# EAGLE design cooldrv (EAGLE 5.11)
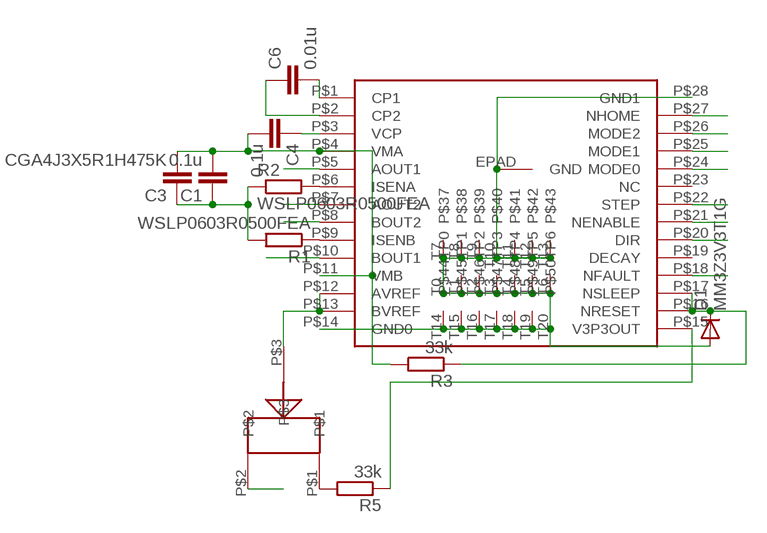
[diagram p0: schematic, sheet 1]

## Parts
C1  0.1u  C-EUC0603  [C0603]
C3  CGA4J3X5R1H475K  C-EUC0805K  [C0805K]
C4  0.1u  C-EUC0603K  [C0603K]
C6  0.01u  C-EUC0603  [C0603]
D1  MM3Z3V3T1G  DIODE-SOD323-R  [SOD323-R]
R1  WSLP0603R0500FEA  0805CS  [0805C]
R2  WSLP0603R0500FEA  0805CS  [0805C]
R3  33k  R-EU_R0603  [R0603]
R5  33k  R-EU_R0603  [R0603]
U$1  DRV8825  [ETSSOP28]
U$2  EVM-3YSX50B14  TRIMMER3MM  [TRIMMER3MM]

## Nets
A1: U$1.P$5(AOUT1)
A2: U$1.P$7(AOUT2)
B1: U$1.P$10(BOUT1)
B2: U$1.P$8(BOUT2)
DIR: U$1.P$20(DIR)
EN: U$1.P$21(NENABLE)
FAULT: U$1.P$18(NFAULT)
GND: C1.1 C3.1 D1.A R1.2 R2.1 U$1.EPAD(GND) U$1.P$14(GND0) U$1.P$28(GND1) U$1.T0(TP0) U$1.T1(TP1) U$1.T2(TP2) U$1.T3(TP3) U$1.T4(TP4) U$1.T5(TP5) U$1.T6(TP6) U$1.T7 U$1.T8 U$1.T9 U$1.T10 U$1.T11 U$1.T12 U$1.T13 U$1.T14 U$1.T15 U$1.T16 U$1.T17 U$1.T18 U$1.T19 U$1.T20 U$2.P$2
HOME: U$1.P$27(NHOME)
MS1: U$1.P$24(MODE0)
MS2: U$1.P$25(MODE1)
MS3: U$1.P$26(MODE2)
N$1: D1.C R3.1 U$1.P$16(NRESET) U$1.P$17(NSLEEP)
N$3: R2.2 U$1.P$6(ISENA)
N$4: R1.1 U$1.P$9(ISENB)
N$6: C6.2 U$1.P$1(CP1)
N$7: C6.1 U$1.P$2(CP2)
N$8: C4.1 U$1.P$3(VCP)
N$11: R5.2 U$2.P$1
N$12: R5.1 U$1.P$15(V3P3OUT)
REF: U$1.P$12(AVREF) U$1.P$13(BVREF) U$2.P$3
STEP: U$1.P$22(STEP)
VMOT: C1.2 C3.2 C4.2 R3.2 U$1.P$4(VMA) U$1.P$11(VMB)
Unconnected: U$1.P$19(DECAY) U$1.P$23(NC)

## Library data of the parts
C1 C3 C4 C6 = rcl:C-EU: CAPACITOR, European symbol
D1 = diode:DIODE-: DIODE
R1 R2 = untitled:0805CS
R3 R5 = rcl:R-EU_: RESISTOR, European symbol
U$1 = untitled:DRV8825
U$2 = untitled:TRIMMER3MM

## Board
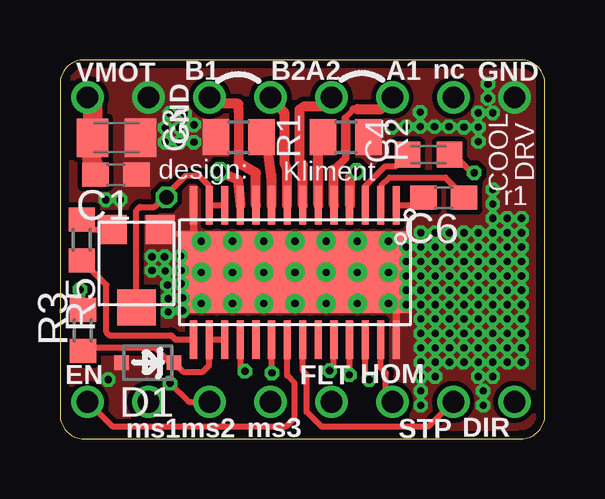
[diagram p1: board, top side]
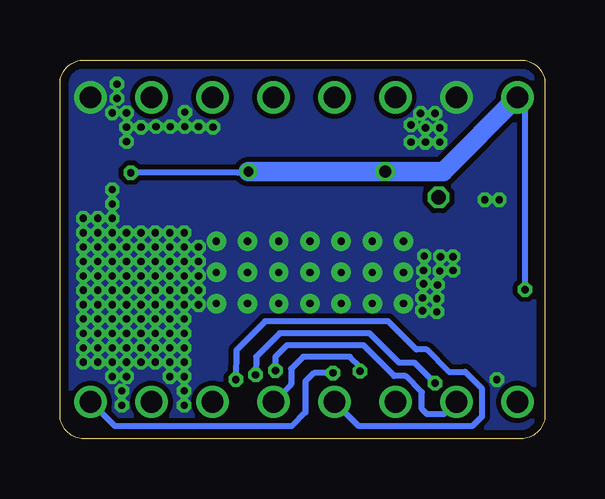
[diagram p2: board, bottom side, seen from below]

Size 20.2 x 15.8 mm. Coordinates in mm from the lower left corner, seen from the top.
Outline: 19.2,0 arc90 20.2,1 20.2,14.8 arc90 19.2,15.8 1,15.8 arc90 0,14.8 0,1 arc90 1,0 19.2,0
Copper layers (1*16): Top 0.035mm / dielectric 1.5mm / Bottom 0.035mm
Design rules "default *": minimum track width 8mil, minimum drill 0.3mm, track to track 8mil, track to pad 8mil, pad to pad 8mil, via to via 8mil, smd to smd 0mil, copper to edge 0.35mm, drill to drill 8mil, minimum pad ring 10mil, minimum via ring 0.15mm, stop-mask expansion 2mil, vias tented up to drill 20mil, thermal gap 10mil

### Footprints (pad centres in the part's own frame; a part is rotated, then mirrored left to right if it is on the bottom)
C0603 = smd 1.1 x 1: 1 -0.85,0; 2 0.85,0
C0805K = smd 1.3 x 1.6: 1 -1,0; 2 1,0
C0603K = smd 1.05 x 1.08: 1 -0.875,0; 2 0.875,0
SOD323-R = smd 0.6 x 0.6: A 1.1,0; C -1.1,0
0805C = smd 1.1 x 1.5: 1 -0.95,0; 2 0.95,0
R0603 = smd 1 x 1.1: 1 -0.85,0; 2 0.85,0
ETSSOP28 = smd 3.4 x 9.7: EPAD 0,0 | smd 1.6 x 0.3: P$1 -2.8,4.225; P$2 -2.8,3.575; P$3 -2.8,2.925; P$4 -2.8,2.275; P$5 -2.8,1.625; P$6 -2.8,0.975; P$7 -2.8,0.325; P$8 -2.8,-0.325; P$9 -2.8,-0.975; P$10 -2.8,-1.625; P$11 -2.8,-2.275; P$12 -2.8,-2.925; P$13 -2.8,-3.575; P$14 -2.8,-4.225; P$15 2.8,-4.225; P$16 2.8,-3.575; P$17 2.8,-2.925; P$18 2.8,-2.275; P$19 2.8,-1.625; P$20 2.8,-0.975; P$21 2.8,-0.325; P$22 2.8,0.325; P$23 2.8,0.975; P$24 2.8,1.625; P$25 2.8,2.275; P$26 2.8,2.925; P$27 2.8,3.575; P$28 2.8,4.225 | drill 0.3 pad 0.61 round: T0 -1.3,3.9; T1 0,3.9; T2 1.3,3.9; T3 -1.3,2.6; T4 0,2.6; T5 1.3,2.6; T6 -1.3,1.3; T7 0,1.3; T8 1.3,1.3; T9 -1.3,0; T10 0,0; T11 1.3,0; T12 -1.3,-1.3; T13 0,-1.3; T14 1.3,-1.3; T15 -1.3,-2.6; T16 0,-2.6; T17 1.3,-2.6; T18 -1.3,-3.9; T19 0,-3.9; T20 1.3,-3.9
TRIMMER3MM = smd 1.2 x 1.2: P$1 1,-1.6; P$2 -1,-1.6 | smd 1.6 x 1.5: P$3 0,1.65

### Placement (x,y rotation side)
C1  2.33,11.02 180 top
C3  2.35,12.55 180 top
C4  15.35,11.85 0 top
C6  15.99,10.05 180 top
D1  3.65,3.17 180 top
R1  7.44,12.58 180 top
R2  11.91,12.57 180 top
R3  0.95,4.52 90 top
R5  0.9,8.29 90 top
U$1  9.79,6.94 270 top
U$2  3.18,7.13 180 top

### Tracks (layer width: path | path; a pad name or v marks a point on that pad's centre or on a via)
A1  (via drill 0.9)
  Top 0.254: 11.89,13.37 12.23,13.74
  Top 0.305: 11.42,11.23 11.91,11.71 11.91,11.97 | 11.91,13.18 11.89,13.37 | 12.23,13.74 12.4,13.74 | 13.36,13.74 v13.85,14.24
  Top 0.39: 11.91,11.97 11.91,13.18
  Top 0.406: U$1.P$5 11.42,11.23 | 12.4,13.74 12.4,13.75 13.36,13.74
A2  (via drill 0.9)
  Top 0.254: 11.04,13.87 v11.31,14.24
  Top 0.406: U$1.P$7 10.12,11.43 9.98,11.59 9.98,13.74 10.18,13.87 11.04,13.87
B1  (via drill 0.9)
  Top 0.254: 6.5,13.97 v6.23,14.24
  Top 0.39: 7.45,11.49 7.45,13.64
  Top 0.406: U$1.P$10 8.17,11.08 7.45,11.49 | 7.45,13.64 7.43,13.97 6.5,13.97
B2  (via drill 0.9)
  Top 0.254: 9.36,13.57 9.28,13.7 9.33,13.63
  Top 0.406: U$1.P$8 9.47,11.18 9.36,11.49 9.36,13.57 | 9.33,13.63 v8.77,14.24
DIR  (via drill 0.3, 0.9)
  Top 0.254: U$1.P$20 8.82,2.76 v8.83,2.75
  Bottom 0.254: v18.93,1.54 17.91,0.52 10.56,0.52 9.98,1.09 9.98,2.4 9.63,2.75 v8.83,2.75
EN  (via drill 0.9)
  Top 0.254: U$1.P$21 9.47,2.64 9.78,2.32 9.78,0.87 9.43,0.52 2.17,0.52 v1.15,1.54
FAULT  (via drill 0.3, 0.9)
  Top 0.254: U$1.P$18 7.51,3.01 v7.71,2.82
  Bottom 0.254: 11.26,1.79 11.06,1.79 v11.31,1.54 10.58,2.27 10.58,2.92 10.08,3.42 8.13,3.42 7.71,3 v7.71,2.82
GND  (via drill 0.3, 0.9)
  Top 0.254: 5.56,8.56 4.72,8.56 U$2.P$2
  Top 0.305: U$1.P$14 5.56,8.56 U$1.T18 U$1.T15 U$1.T12 | U$1.P$28 14.02,5.31 U$1.T2 | U$1.T2 U$1.T1 U$1.T0 U$1.T3 U$1.T4 | U$1.T2 U$1.T5 U$1.T8 U$1.T11 U$1.EPAD | U$1.EPAD U$1.T9 U$1.T12 | U$1.EPAD U$1.T7 11.08,8.17 11.09,8.18 U$1.T6 | U$1.T13 U$1.EPAD | U$1.T12 U$1.T13 | U$1.T13 8.48,6.92 U$1.T14 U$1.T17 U$1.T20 | U$1.T19 U$1.T16 U$1.T13
  other vias: 3.69,14.24 18.93,14.24 2,2.47 5.58,13.09 4.58,13.57 5.18,13.57 4.98,12.97 4.38,12.97 4.38,12.37 4.98,12.37 5.58,12.37 13.83,12.99 14.43,13.02 15.01,13.02 15.01,13.62 15.61,13.02 16.2,13.02 16.83,12.99 17.43,12.99 17.43,12.39 17.43,13.59 1.9,9.97 2.5,9.97 5.03,7.62 4.35,7.6 3.83,7.6 3.83,7.02 4.38,6.99 5.05,7.02 5.05,6.47 4.48,6.42 4.5,5.85 5.1,5.87 5.1,5.35 4.5,5.29 15.03,8.59 15.63,8.59 15.03,7.99 15.63,7.99 15.03,7.39 15.63,7.39 15.63,6.79 15.03,6.79 15.03,6.2 15.63,6.2 15.03,5.6 15.63,5.6 15.03,4.99 15.63,4.99 15.03,4.39 15.63,4.39 15.03,3.79 15.63,3.79 15.63,3.19 15.03,3.19 15.03,2.6 16.23,3.19 16.23,3.79 16.23,4.39 16.23,4.99 16.23,5.6 16.23,6.2 16.23,6.79 16.23,7.39 16.23,7.99 16.23,8.59 16.83,8.59 17.43,8.59 16.83,7.99 17.43,7.99 16.83,7.39 17.43,7.39 17.43,6.79 16.83,6.79 16.83,6.2 17.43,6.2 16.83,5.6 17.43,5.6 16.83,4.99 17.43,4.99 16.83,4.39 17.43,4.39 16.83,3.79 17.43,3.79 17.43,3.19 16.83,3.19 18.03,3.19 18.03,3.79 18.03,4.39 18.03,4.99 18.03,5.6 18.03,6.2 18.03,6.79 18.03,7.39 18.03,7.99 18.03,8.59 18.63,8.59 18.63,7.99 18.63,7.39 18.63,6.79 18.63,6.2 18.63,5.6 18.63,4.99 18.63,4.39 18.63,3.79 18.63,3.19 19.23,3.19 19.23,3.79 19.23,4.39 19.23,4.99 19.23,5.6 19.23,6.2 19.23,6.79 19.23,7.39 19.23,7.99 19.23,8.59 15.63,2.6 17.43,2.6 18.03,2.6 15.03,2 15.03,1.4 17.63,2 17.63,1.4 14.43,7.99 14.43,7.39 14.43,6.79 14.43,6.2 14.43,5.6 18.03,9.2 18.63,9.2 19.23,9.2 18.03,9.79 18.03,10.39 18.03,13.59 17.83,14.2 17.83,14.79
  pour Top (no thermals): -0.87,16.22 20.9,16.22 20.9,-0.38 -1.37,-0.38 -1.37,15.72
  pour Bottom: -2.82,17.67 23.03,17.67 23.03,-0.6 -4.04,-0.6 -4.04,16.05
HOME  (via drill 0.9)
  Top 0.254: U$1.P$27 13.37,2.96 13.58,2.75 13.58,1.81 v13.85,1.54
MS1  (via drill 0.3, 0.9)
  Top 0.254: U$1.P$24 11.42,2.98 v11.23,2.85
  Bottom 0.254: v11.23,2.85 11.23,3.42 10.76,3.9 7.55,3.9 6.28,2.62 5.8,2.62 5.13,1.95 5.13,1.25 4.91,1.02 4.21,1.02 v3.69,1.54
MS2  (via drill 0.3, 0.9)
  Top 0.254: U$1.P$25 12.07,2.75 v12.06,2.67 | v6.23,1.54 5.36,1.54 v4.58,2.32
  Bottom 0.254: v12.06,2.67 12.03,3.42 11.06,4.39 7.3,4.39 6.08,3.17 5.43,3.17 v4.58,2.32
MS3  (via drill 0.3, 0.9)
  Top 0.254: U$1.P$26 12.72,2.64 v12.88,2.47
  Bottom 0.254: v12.88,2.47 12.86,3.69 11.66,4.89 6.53,4.89 5.35,3.72 4.93,3.72 4,2.79 3.33,2.79 2.63,2.09 2.63,0.92 3.03,0.52 7.75,0.52 v8.77,1.54
N$1
  Top 0.254: U$1.P$17 U$1.P$16 6.21,3.06 5.96,2.79 5.13,2.79 D1.C 4.58,3.19 3.96,3.82 1,3.82 R3.1
N$3
  Top 0.254: 10.77,12.38 R2.2
  Top 0.406: U$1.P$6 10.77,12.38
N$4
  Top 0.254: R1.1 8.72,12.33
  Top 0.406: U$1.P$9 8.82,10.79 8.81,10.99 8.61,12.42 R1.1
N$6
  Top 0.254: U$1.P$1 15.48,9.74 C6.2
N$7
  Top 0.254: C6.1 16.83,10.08 16.83,10.12 16.05,10.89 13.73,10.89 13.37,10.53 U$1.P$2
N$8
  Top 0.254: C4.1 14,11.37 13.56,11.37 12.72,10.53 U$1.P$3
N$11
  Top 0.254: U$2.P$1 1.32,8.73 R5.2
N$12
  Top 0.254: U$1.P$15 4.81,4.14 4.63,4.32 2.05,4.32 1.93,4.45 1.93,6.42 R5.1
NC  (via drill 0.9)
  other vias: 16.39,14.24
REF  (via drill 0.6)
  Top 0.254: U$1.P$12 U$1.P$13 6.21,10.54 5.78,10.97 5.23,10.97 4.43,10.17 v4.43,10.07 3.93,9.67 3.33,9.67 3.18,9.52 U$2.P$3
STEP  (via drill 0.9)
  Top 0.254: U$1.P$22 10.12,2.83 10.28,2.67 10.28,1.12 10.88,0.52 15.37,0.52 v16.39,1.54
VMOT  (via drill 0.3, 0.4, 0.5, 0.9)
  Top 0.254: 12.08,9.75 U$1.P$4 | C4.2 16.4,11.85 17.11,11.14 v17.25,11.09 | R3.2 0.95,6.1 v0.83,6.22
  Top 0.406: U$1.P$11 7.42,10.81 v6.66,11.14 | v12.36,11.14 12.08,10.92 12.08,9.75
  Top 0.813: C1.2 1.15,12.36 C3.2 1.35,14.04 v1.15,14.24
  Bottom 0.254: v17.25,11.09 12.78,11.09 v12.36,11.14 | v0.83,6.22 0.83,13.92 v1.15,14.24
  Bottom 0.813: v12.36,11.14 v6.66,11.14 4.25,11.14 v1.15,14.24

### Text on the board
tPlace: VMOT | GND | B1 | B2 | A2 | A1 | nc | GND | COOL | DRV | design: | Kliment | r1 | EN | FLT | HOM | ms2 | STP | DIR | ms1 | ms3